# Altium schematic sheet ZW Radio.SchDoc
size A; SheetNumber: 6; SheetTotal: 6
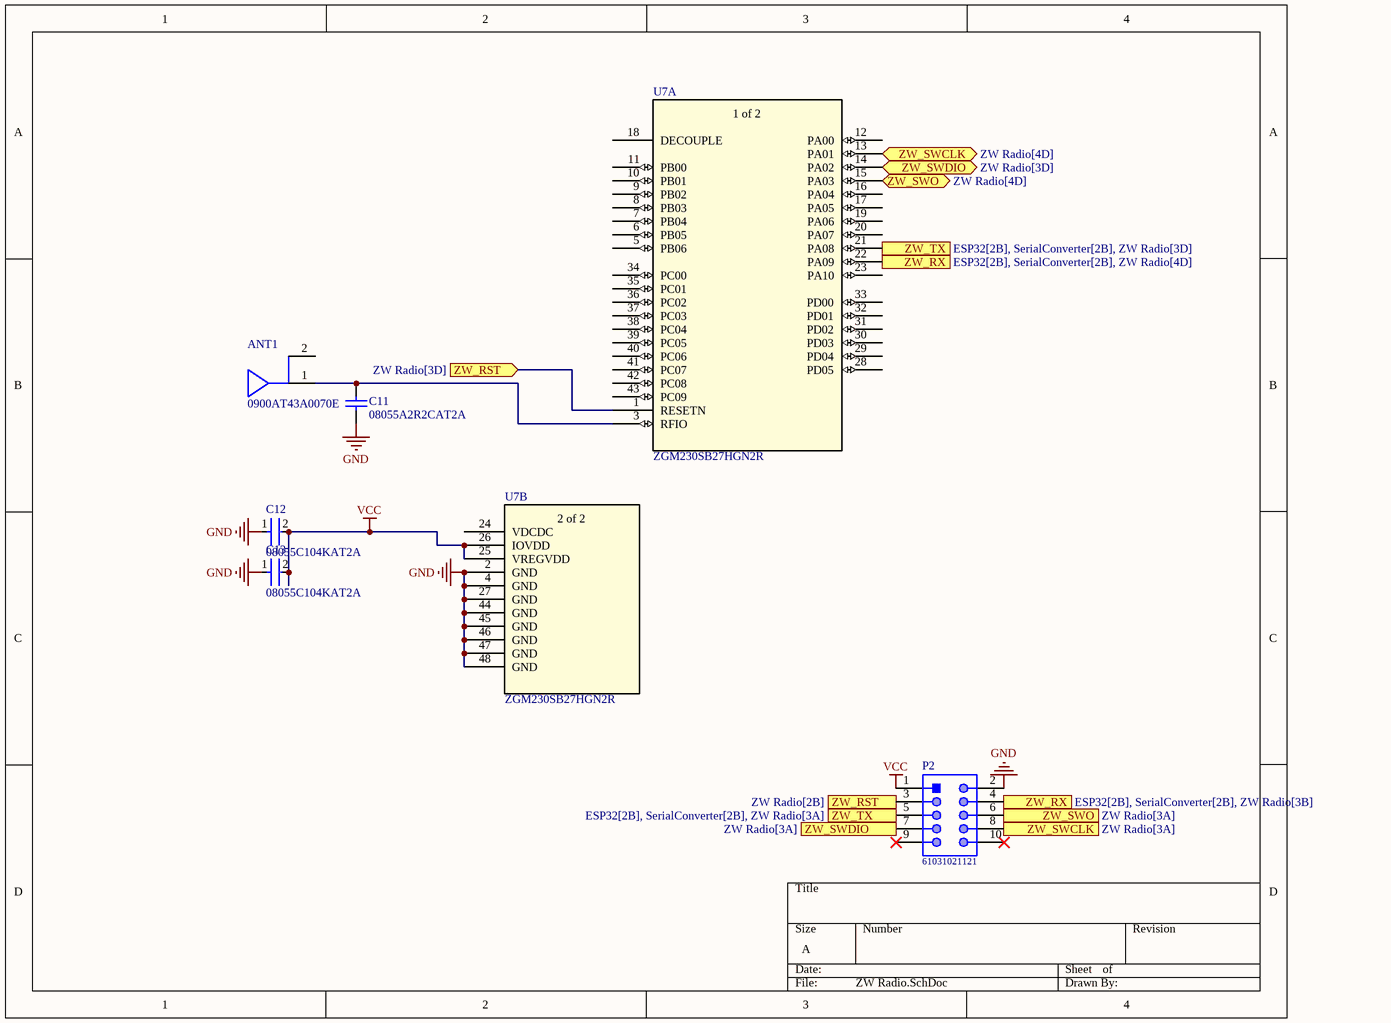
[diagram p0: ZW Radio.SchDoc]

## Parts
ANT1  0900AT43A0070E  [FP-0900AT43A0070E-MFG]
C11  08055A2R2CAT2A  [CAPC2013X94X50NL20T25]
C12  08055C104KAT2A  [FP-0805-L_2_01_0_2-W_1_25-IPC_C]
C13  08055C104KAT2A  [FP-0805-L_2_01_0_2-W_1_25-IPC_C]
P2  61031021121  [61031021121]
U7  ZGM230SB27HGN2R  [QFN44_ZGM230S_SIL]  (parts A,B of 2)

## Ports
ZW_RST (in, see ZW Radio[2B]), ZW_RST (in, see ZW Radio[3D]), ZW_RX (in, see ESP32[2B], SerialConverter[2B], ZW Radio[4D]), ZW_RX (out, see ESP32[2B], SerialConverter[2B], ZW Radio[3B]), ZW_SWCLK (bidir, see ZW Radio[4D]), ZW_SWCLK (see ZW Radio[3A]), ZW_SWDIO (bidir, see ZW Radio[3D]), ZW_SWDIO (see ZW Radio[3A]), ZW_SWO (bidir, see ZW Radio[4D]), ZW_SWO (see ZW Radio[3A]), ZW_TX (in, see ESP32[2B], SerialConverter[2B], ZW Radio[3A]), ZW_TX (out, see ESP32[2B], SerialConverter[2B], ZW Radio[3D])

## Nets
GND: C11.1 C12.1 C13.1 P2.2 U7.2(GND) U7.4(GND) U7.27(GND) U7.44(GND) U7.45(GND) U7.46(GND) U7.47(GND) U7.48(GND)
VCC: C12.2 C13.2 P2.1 U7.25(VREGVDD) U7.26(IOVDD)
ZW_RST: P2.3 U7.1(RESETN) ; port ZW_RST
ZW_RX: P2.4 U7.22(PA09) ; port ZW_RX
ZW_SWCLK: P2.8 U7.13(PA01) ; port ZW_SWCLK
ZW_SWDIO: P2.7 U7.14(PA02) ; port ZW_SWDIO
ZW_SWO: P2.6 U7.15(PA03) ; port ZW_SWO
ZW_TX: P2.5 U7.21(PA08) ; port ZW_TX
NetANT1_1: ANT1.1(RF_Feeding_Point) C11.2 U7.3(RFIO)

Not connected (* = marked no-connect by the designer): ANT1 2(To_trace_element); P2 9* 10*; U7 5(PB06) 6(PB05) 7(PB04) 8(PB03) 9(PB02) 10(PB01) 11(PB00) 12(PA00) 16(PA04) 17(PA05) 18(DECOUPLE) 19(PA06) 20(PA07) 23(PA10) 24(VDCDC) 28(PD05) 29(PD04) 30(PD03) 31(PD02) 32(PD01) 33(PD00) 34(PC00) 35(PC01) 36(PC02) 37(PC03) 38(PC04) 39(PC05) 40(PC06) 41(PC07) 42(PC08) 43(PC09)

## Notes on the sheet
- (in symbol CMP-009-000001-5, part A) 1 of 2
- (in symbol CMP-009-000001-5, part B) 2 of 2

## Library data of the parts
ANT1 = CMP-56579-000002-1: RF ANT CHIP SOLDER SMD; Impedance: 50R; Max Frequency: 928MHz; Number of Pins: 2; Mount: Surface Mount; RoHS Compliant: No; Contact Plating: Tin
C11 = CMP-1036-00283-2: Manufacturer: AVX Interconnect / Elco; Part Number: 08055A2R2CAT2A
C12 C13 = CMP-2000-05016-2: General Purpose Ceramic Capacitor, 0805, 100nF, 10%, X7R, 0.15, 50V; Dissipation Factor: 2.5%; Insulation Resistance: 100GR; Voltage Rating (DC): 50V; Package Quantity: 4000; Tolerance: 10%; Voltage Rating: 50V; Dielectric: X7R; Case/Package: 0805; Lead Free: Lead Free; Dielectric Material: Ceramic; Thickness: 0.037inch; Weight: 0.001411oz; Max Operating Temperature: 125°C; REACH SVHC: No SVHC; Mount: Surface Mount; RoHS Compliant: Yes; Depth: 1.25mm; Height: 0.5mm; Case Code (Metric): 2012; Length: 2mm; Termination: Standard; Case Code (Imperial): 0805; Number of Pins: 2; Voltage: 50V; Radiation Hardening: No; Min Operating Temperature: -55°C; Capacitance: 100nF; Width: 1.2mm; Series: MLCC X7R; Packaging: Cut Tape
P2 = CMP-1502-01053-1: SMT Vertical Pin Header WR-PHD, Pitch 2.54 mm, Dual Row, 10 pins; Manufacturer: Wurth Elektronik; Gender: Male; Rated Current: 3A; Working Voltage: 250VAC; Withstanding Voltage: 500VAC; Pitch: 2.54mm; Pin Number: 10; Contact Resistance: 20mOhm; Packaging: TapeandReel; Part Number: 61031021121; Mounting Technology: SMT; Package Reference: 61031021121; Operating Temperature: -40to125degC; Manufacturer URL: http://www.we-online.de; Publisher: WurthElektronik; Datasheet URL: https://katalog.we-online.de/em/datasheet/6103xx21121.pdf; Orientation: Vertical; Row Number: Dual
U7 = CMP-009-000001-5: No Description Available; Mfr_Name: Silicon Labs; RefDes: RefDes; Type: Interface; Source: ZGM230SB27HGN2R.SchLib; Design Item ID: ZGM230SB27HGN2R